# Altium project Sensor_Box_CAN_SENS.PrjPCB
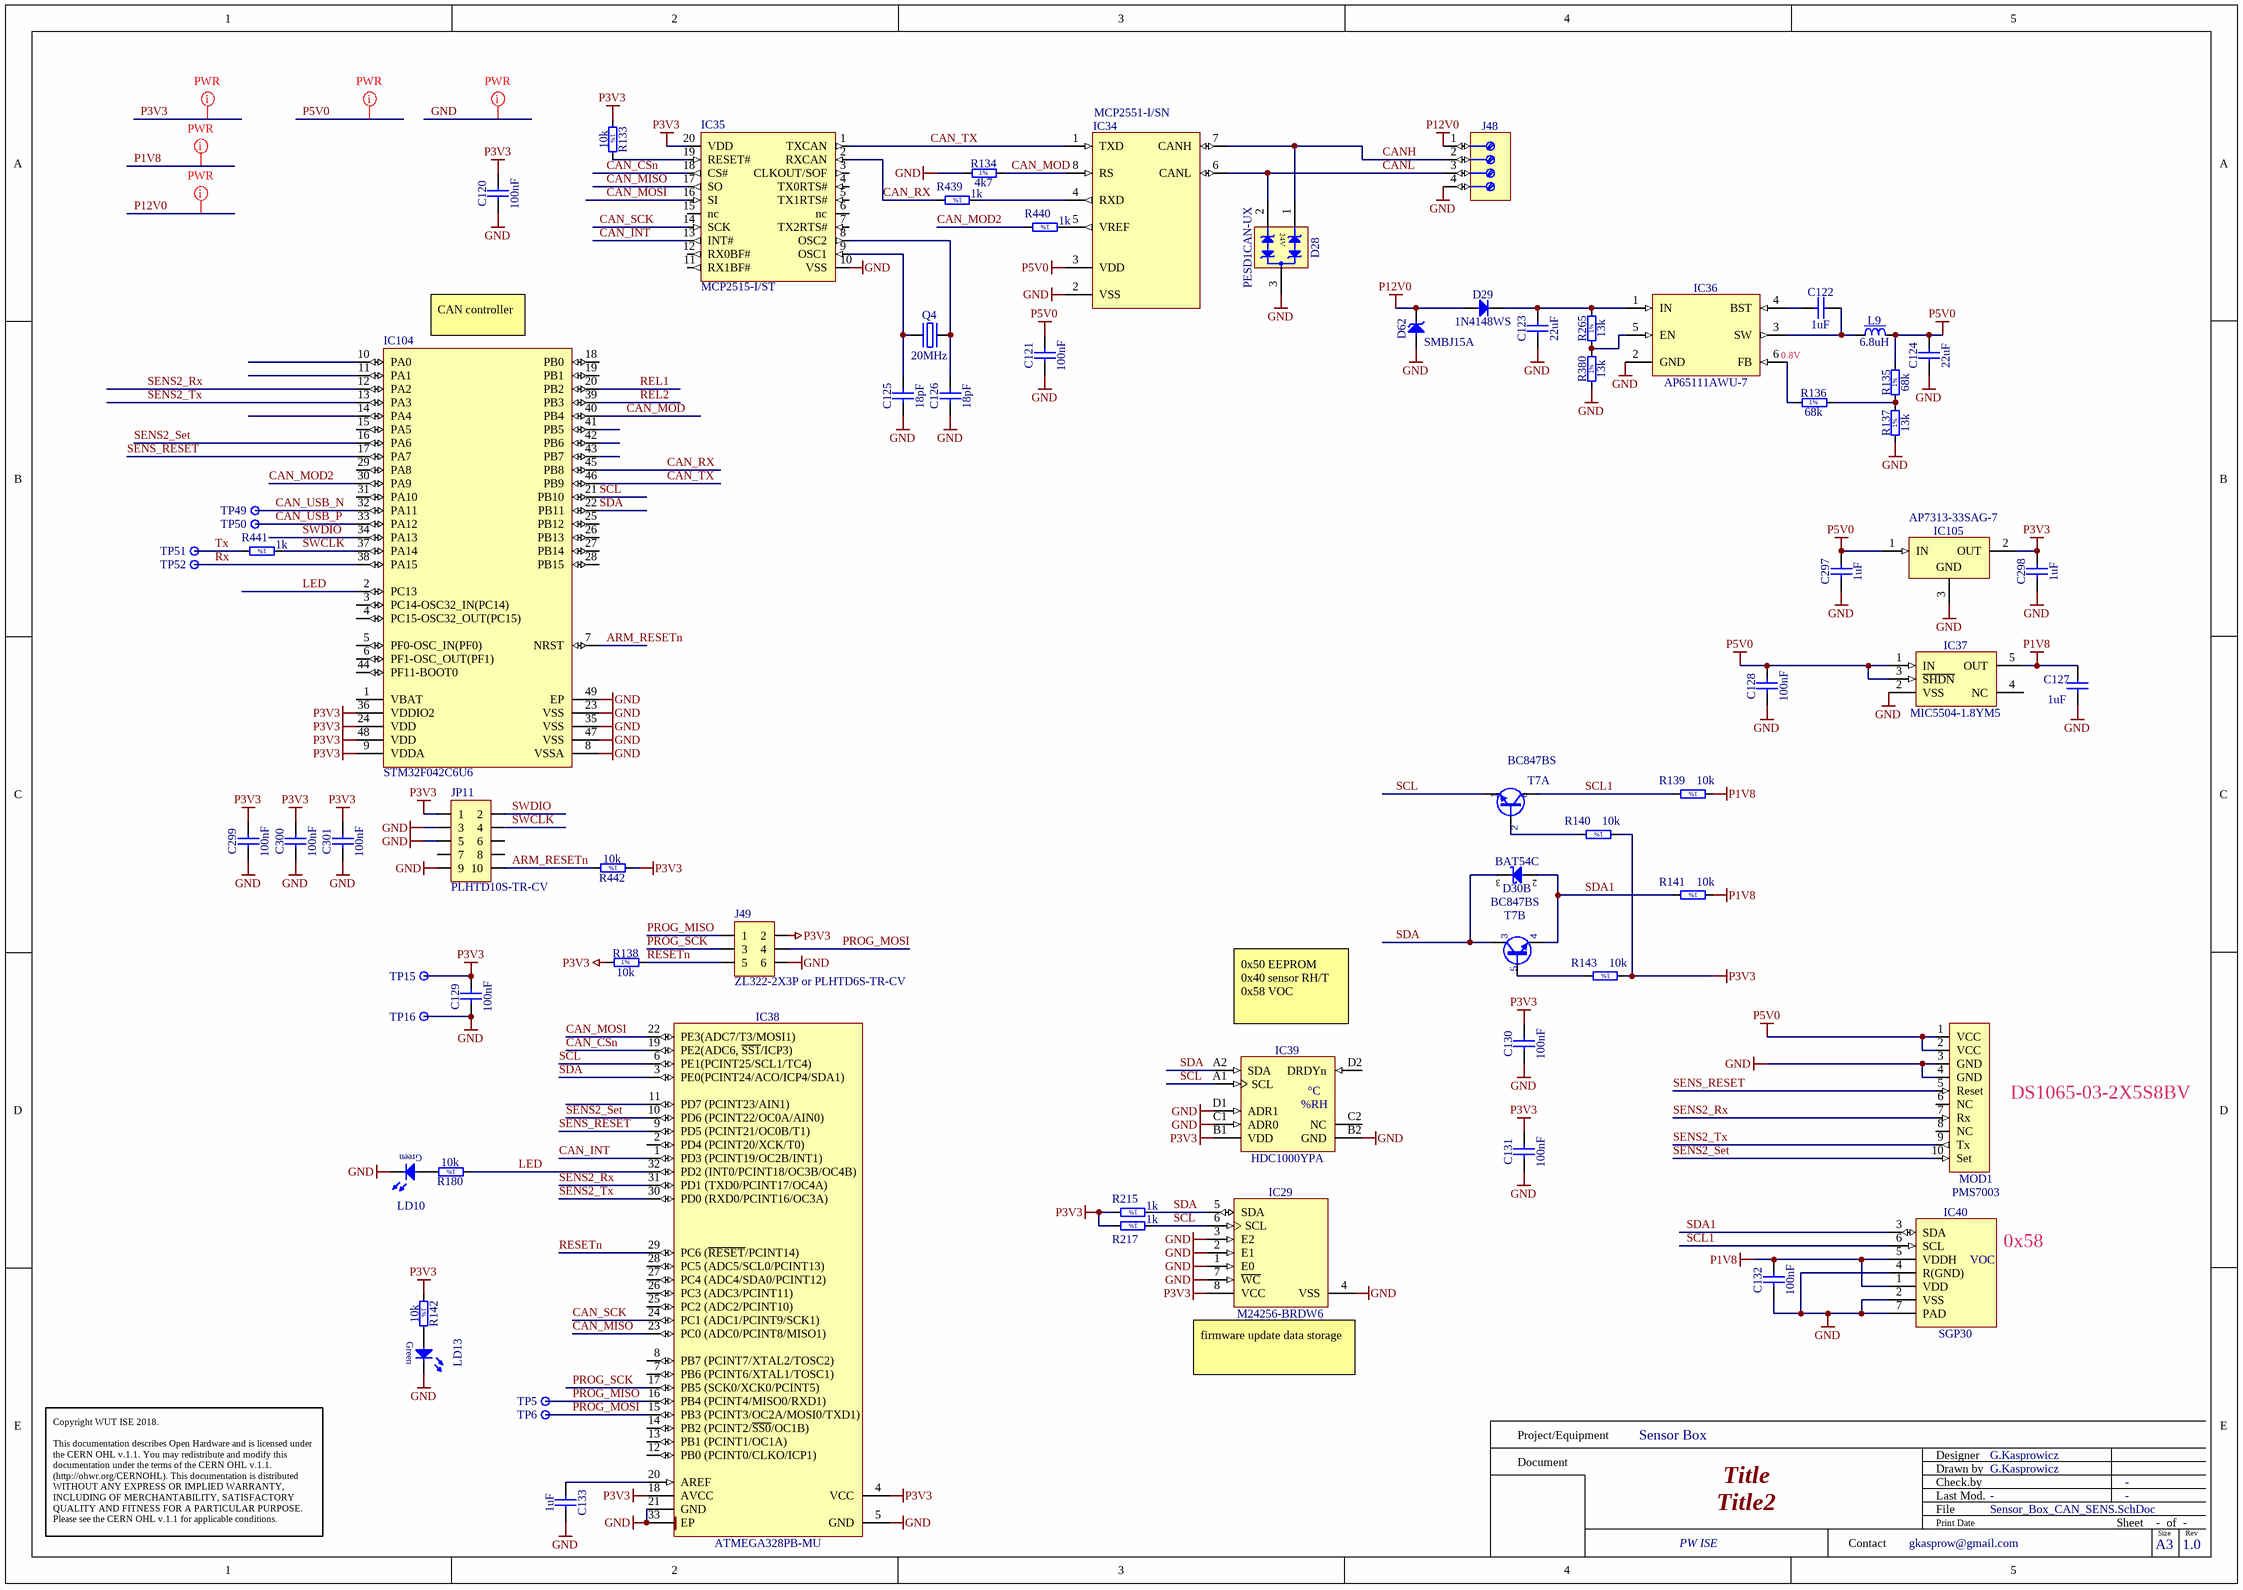
[diagram p0: Sensor_Box_CAN_SENS.SchDoc]
1 sheet, 70 parts. Net scope: global (net labels, ports and power ports of the same name join across sheets).
Board file: Sensor_Box_CAN_SENS.PCBDOC

## Sheet Sensor_Box_CAN_SENS.SchDoc: Title
size 420 x 297 mm; Author: G.Kasprowicz; CompanyName: WUT ISE; DrawnBy: G.Kasprowicz; Organization: WUT ISE; Address1: PW ISE; Address2: Nowowiejska 15/19 00-665 Warsaw; Address3: gkasprow@gmail.com; Revision: 1.0; SheetNumber: -; SheetTotal: -; ModifiedBy: -; CheckedDate: -; Title2: Title2; DivGrp: WUT ISE; Designer: G.Kasprowicz; ModifiedDate: -; ProjectName: Sensor Box

### Parts
C120  100nF  [CAPC1005X55N]
C121  100nF  [CAPC1005X55N]
C122  1uF  [CAPC1005X55N]
C123  22uF  [CAPC1709X100N]
C124  22uF  [CAPC1709X100N]
C125  18pF  [CAPC1005X55N]
C126  18pF  [CAPC1005X55N]
C127  1uF  [CAPC1608X87N]
C128  100nF  [CAPC1005X55N]
C129  100nF  [CAPC1005X55N]
C130  100nF  [CAPC1005X55N]
C131  100nF  [CAPC1005X55N]
C132  100nF  [CAPC1005X55N]
C133  1uF  [CAPC1005X55N]
C297  1uF  [CAPC1005X55N]
C298  1uF  [CAPC1005X55N]
C299  100nF  [CAPC1005X55N]
C300  100nF  [CAPC1005X55N]
C301  100nF  [CAPC1005X55N]
D28  PESD1CAN-UX  [SOT95P237X112-3N]
D29  1N4148WS  [SODFL2512X100N]
D30  BAT54C  [SOT95P240X130-3N]  (part B of 2)
D62  SMBJ15A  [DIOM5336X265N]
IC29  M24256-BRDW6  [SOP65P640X120-8N]
IC34  MCP2551-I/SN  [SOIC127P600X175-8N]
IC35  MCP2515-I/ST  [SOP65P640X110-20N]
IC36  AP65111AWU-7  [SOT95P280X100-6N]
IC37  MIC5504-1.8YM5  [SOT95P270X145-5N]
IC38  ATMEGA328PB-MU  [QFN50P500X500X100-33N-S325]
IC39  HDC1000YPA  [BGA8C100X50P2X4_159X204X68]
IC40  SGP30  [SON80P250X90_HS-7N]
IC104  STM32F042C6U6  [STM-UFQFPN48_L]
IC105  AP7313-33SAG-7  [SOT95P240X130-3N]
J48  (no value)  [PHOENIX_1725672]
J49  ZL322-2X3P or PLHTD6S-TR-CV  [ZL322-2X3P]
JP11  PLHTD10S-TR-CV  [PLHTD10S-TR-CV]
L9  6.8uH  [IND_WALSIN_WLPN3030]
LD10  Green  [LED_KINGBRIGHT_KPTR3216]  (value not drawn)
LD13  Green  [LED_KINGBRIGHT_KPTR3216]  (value not drawn)
MOD1  PMS7003  [PLANTOWER_PMS7003]
Q4  20MHz  [XTAL1160X490X430]
R133  10k  [RESC1005X40N]
R134  4k7  [RESC1005X40N]
R135  68k  [RESC1005X40N]
R136  68k  [RESC1005X40N]
R137  13k  [RESC1005X40N]
R138  10k  [RESC1005X40N]
R139  10k  [RESC1005X40N]
R140  10k  [RESC1005X40N]
R141  10k  [RESC1005X40N]
R142  10k  [RESC1005X40N]
R143  10k  [RESC1005X40N]
R180  10k  [RESC1005X40N]
R215  1k  [RESC1005X40N]
R217  1k  [RESC1005X40N]
R265  13k  [RESC1005X40N]
R380  13k  [RESC1005X40N]
R439  1k  [RESC1005X40N]
R440  1k  [RESC1005X40N]
R441  1k  [RESC1005X40N]
R442  10k  [RESC1005X40N]
T7  BC847BS  [SOT65P210X110-6N]  (parts A,B of 2)
TP5  Test Point  [TPS127]  (value not drawn)
TP6  Test Point  [TPS127]  (value not drawn)
TP15  Test Point  [TPS127]  (value not drawn)
TP16  Test Point  [TPS127]  (value not drawn)
TP49  Test Point  [TPS127]  (value not drawn)
TP50  Test Point  [TPS127]  (value not drawn)
TP51  Test Point  [TPS127]  (value not drawn)
TP52  Test Point  [TPS127]  (value not drawn)

### Nets
GND: C120.1 C121.1 C123.1 C124.1 C125.1 C126.1 C127.2 C128.1 C129.1 C130.1 C131.1 C132.1 C133.2 C297.1 C298.1 C299.1 C300.1 C301.1 D28.3(GND) D62.2(A) IC29.1(E0) IC29.2(E1) IC29.3(E2) IC29.4(VSS) IC29.7(~{WC}) IC34.2(VSS) IC35.10(VSS) IC36.2(GND) IC37.2(VSS) IC38.5(GND) IC38.21(GND) IC38.33(EP) IC39.B2(GND) IC39.C1(ADR0) IC39.D1(ADR1) IC40.2(VSS) IC40.4(R(GND)) IC40.7(PAD) IC104.8(VSSA) IC104.23(VSS) IC104.35(VSS) IC104.47(VSS) IC104.49(EP) IC105.3(GND) J48.4 J49.6 JP11.3 JP11.5 JP11.9 LD10.1(C) LD13.1(C) MOD1.3(GND) MOD1.4(GND) R134.1 R137.1 R380.1 TP16.1
P1V8: C127.1 C132.2 IC37.5(OUT) IC40.1(VDD) IC40.5(VDDH) R139.1 R141.1
P3V3: C120.2 C129.2 C130.2 C131.2 C298.2 C299.2 C300.2 C301.2 IC29.8(VCC) IC35.20(VDD) IC38.4(VCC) IC38.18(AVCC) IC39.B1(VDD) IC104.9(VDDA) IC104.24(VDD) IC104.36(VDDIO2) IC104.48(VDD) IC105.2(OUT) J49.2 JP11.1 R133.1 R138.1 R140.1 R142.1 R143.1 R215.2 R217.2 R442.1 TP15.1
P5V0: C121.2 C124.2 C128.2 C297.2 IC34.3(VDD) IC37.1(IN) IC37.3(~{SHDN}) IC105.1(IN) L9.2 MOD1.1(VCC) MOD1.2(VCC) R135.2
P12V0: D29.2(A) D62.1(C) J48.1
ARM_RESETn: IC104.7(NRST) JP11.10 R442.2
CAN_CSn: IC35.18(CS#) IC38.19(PE2(ADC6,_~{SS1}/ICP3))
CAN_INT: IC35.13(INT#) IC38.1(PD3_(PCINT19/OC2B/INT1))
CAN_MISO: IC35.17(SO) IC38.23(PC0_(ADC0/PCINT8/MISO1))
CAN_MOD: IC34.8(RS) IC104.40(PB4) R134.2
CAN_MOD2: IC104.30(PA9) R440.2
CAN_MOSI: IC35.16(SI) IC38.22(PE3(ADC7/T3/MOSI1))
CAN_RX: IC35.2(RXCAN) IC104.45(PB8) R439.2
CAN_SCK: IC35.14(SCK) IC38.24(PC1_(ADC1/PCINT9/SCK1))
CAN_TX: IC34.1(TXD) IC35.1(TXCAN) IC104.46(PB9)
CAN_USB_N: IC104.32(PA11) TP49.1
CAN_USB_P: IC104.33(PA12) TP50.1
CANH: D28.1(I/O1) IC34.7(CANH) J48.2
CANL: D28.2(I/O2) IC34.6(CANL) J48.3
LED: IC38.32(PD2_(INT0/PCINT18/OC3B/OC4B)) IC104.2(PC13) R180.1
PROG_MISO: IC38.16(PB4_(PCINT4/MISO0/RXD1)) J49.1 TP5.1
PROG_MOSI: IC38.15(PB3_(PCINT3/OC2A/MOSI0/TXD1)) J49.4 TP6.1
PROG_SCK: IC38.17(PB5_(SCK0/XCK0/PCINT5)) J49.3
REL1: IC104.20(PB2)
REL2: IC104.39(PB3)
RESETn: IC38.29(PC6_(~{RESET}/PCINT14)) J49.5 R138.2
Rx: IC104.38(PA15) TP52.1
SCL: IC29.6(SCL) IC38.6(PE1(PCINT25/SCL1/TC4)) IC39.A1(SCL) IC104.21(PB10) R217.1 T7.1(E)
SCL1: IC40.6(SCL) R139.2 T7.6(C)
SDA: D30.3(COMC) IC29.5(SDA) IC38.3(PE0(PCINT24/ACO/ICP4/SDA1)) IC39.A2(SDA) IC104.22(PB11) R215.1 T7.3(C)
SDA1: D30.2(A) IC40.3(SDA) R141.2 T7.4(E)
SENS2_Rx: IC38.31(PD1_(TXD0/PCINT17/OC4A)) IC104.12(PA2) MOD1.7(Rx)
SENS2_Set: IC38.10(PD6_(PCINT22/OC0A/AIN0)) IC104.16(PA6) MOD1.10(Set)
SENS2_Tx: IC38.30(PD0_(RXD0/PCINT16/OC3A)) IC104.13(PA3) MOD1.9(Tx)
SENS_RESET: IC38.9(PD5_(PCINT21/OC0B/T1)) IC104.17(PA7) MOD1.5(Reset)
SWCLK: IC104.37(PA14) JP11.4 R441.1
SWDIO: IC104.34(PA13) JP11.2
Tx: R441.2 TP51.1
NetC122_1: C122.1 IC36.4(BST)
NetC122_2: C122.2 IC36.3(SW) L9.1
NetC123_2: C123.2 D29.1(C) IC36.1(IN) R265.2
NetC125_2: C125.2 IC35.9(OSC1) Q4.1(OSC1)
NetC126_2: C126.2 IC35.8(OSC2) Q4.2(OSC2)
NetC133_1: C133.1 IC38.20(AREF)
NetIC34_4: IC34.4(RXD) R439.1
NetIC34_5: IC34.5(VREF) R440.1
NetIC35_19: IC35.19(RESET#) R133.2
NetIC36_5: IC36.5(EN) R265.1 R380.2
NetIC36_6: IC36.6(FB) R136.1
NetLD10_2: LD10.2(A) R180.2
NetLD13_2: LD13.2(A) R142.2
NetR135_1: R135.1 R136.2 R137.2
NetR140_2: R140.2 T7.2(B)
NetR143_2: R143.2 T7.5(B)

Not connected (* = marked no-connect by the designer): IC35 3(CLKOUT/SOF) 4(TX0RTS#) 5(TX1RTS#) 6(nc) 7(TX2RTS#) 11(RX1BF#) 12(RX0BF#) 15(nc); IC37 4(NC); IC38 2(PD4_(PCINT20/XCK/T0)) 7(PB6_(PCINT6/XTAL1/TOSC1)) 8(PB7_(PCINT7/XTAL2/TOSC2)) 11(PD7_(PCINT23/AIN1)) 12(PB0_(PCINT0/CLKO/ICP1)) 13(PB1_(PCINT1/OC1A)) 14(PB2_(PCINT2/~{SS0}/OC1B)) 25(PC2_(ADC2/PCINT10)) 26(PC3_(ADC3/PCINT11)) 27(PC4_(ADC4/SDA0/PCINT12)) 28(PC5_(ADC5/SCL0/PCINT13)); IC39 C2(NC) D2(DRDYn); IC104 1(VBAT) 3(PC14-OSC32_IN(PC14)) 4(PC15-OSC32_OUT(PC15)) 5(PF0-OSC_IN(PF0)) 6(PF1-OSC_OUT(PF1)) 10(PA0) 11(PA1) 14(PA4) 15(PA5) 18(PB0) 19(PB1) 25(PB12) 26(PB13) 27(PB14) 28(PB15) 29(PA8) 31(PA10) 41(PB5) 42(PB6) 43(PB7) 44(PF11-BOOT0); JP11 6 7 8; MOD1 6(NC) 8(NC)

### Layout directives
net class PWR: GND, P1V8, P3V3, P5V0, P12V0

### Notes on the sheet
- (near IC104) CAN controller
- (near IC36) 0.8V
- (near IC39) 0x50 EEPROM
  0x40 sensor RH/T
  0x58 VOC
- DS1065-03-2X5S8BV
- 0x58
- (near IC29) firmware update data storage
- Project/Equipment
- Document
- Designer
- Drawn by
- Check.by
- Copyright WUT ISE 2018.
  This documentation describes Open Hardware and is licensed under the CERN OHL v.1.1. You may redistribute and modify this documentation under the terms of the CERN OHL v.1.1. (http://ohwr.org/CERNOHL). This documentation is distributed WITHOUT ANY EXPRESS OR IMPLIED WARRANTY, INCLUDING OF MERCHANTABILITY, SATISFACTORY QUALITY AND FITNESS FOR A PARTICULAR PURPOSE. Please see the CERN OHL v.1.1 for applicable conditions.
- Contact
- File
- Last Mod.
- Print Date
- Sheet
- Size
- A3
- of
- Rev
- (in symbol HDC1000YPA) °C; %RH
- (in symbol R0402_1K_1%_0.0625W_100PPM) 1%
- (in symbol R0402_4K7_1%_0.0625W_100PPM) 1%
- (in symbol R0402_10K_1%_0.0625W_100PPM) 1%
- (in symbol R0402_13K_1%_0.0625W_100PPM) 1%
- (in symbol R0402_68K_1%_0.0625W_100PPM) 1%
- (in symbol SENS_SGP30) VOC

### Library data of the parts
C120 C121 C128-C132 C299-C301 = CC0402_100NF_16V_10%_X5R: Non-polarised capacitor; Part Description: SMD Multilayer Chip Ceramic Capacitor; Manufacturer: GENERIC; Manufacturer1 Part Number: GRM155R61C104KA88D; Voltage: 16V; TC: X5R; Tolerance: ±10%; Part Number: CC0402_100NF_16V_10%_X5R; Component Kind: Standard; Component Type: Standard; Pin Count: 2; Value: 100nF; Status: None; Manufacturer Part Number: CC0402_100NF_16V_10%_X5R; Case: 0402; Mounted: Yes; Socket: No; SMD: Yes; Sense: No; Manufacturer1 Example: MURATA; Manufacturer1 ComponentHeight: 0.55mm; HelpURL: \\cern.ch\dfs\Applications\Altium\Datasheets\CC0402_X5R_MURATA_GRM.pdf; Author: CERN DEM JLC; CreateDate: 10.12.2013; LatestRevisionDate: 10.12.2013
C122 C133 C297 C298 = CC0402_1UF_16V_10%_X5R: Non-polarised capacitor; Part Description: SMD Multilayer Chip Ceramic Capacitor; Manufacturer: GENERIC; Manufacturer1 Part Number: C1005X5R1C105KT; Voltage: 16V; TC: X5R; Tolerance: ±10%; Part Number: CC0402_1UF_16V_10%_X5R; Component Kind: Standard; Component Type: Standard; Pin Count: 2; Value: 1uF; Status: Preferred; Manufacturer Part Number: CC0402_1UF_16V_10%_X5R; Case: 0402; Mounted: Yes; Socket: No; SMD: Yes; Sense: No; Manufacturer1 Example: TDK; Manufacturer1 ComponentHeight: 0.55mm; HelpURL: \\cern.ch\dfs\Applications\Altium\Datasheets\CC0402_X5R_TDK_C.pdf; Author: CERN DEM JLC; CreateDate: 25.10.2012; LatestRevisionDate: 25.10.2012
C123 C124 = CC0603_22UF_6.3V_20%_X5R: Non-polarised capacitor; Part Description: SMD Multilayer Chip Ceramic Capacitor; Manufacturer: GENERIC; Manufacturer1 Part Number: C1608X5R0J226M080AC; Voltage: 6.3V; TC: X5R; Tolerance: ±20%; Part Number: CC0603_22UF_6.3V_20%_X5R; Component Kind: Standard; Component Type: Standard; Pin Count: 2; Value: 22uF; Status: None; Manufacturer Part Number: CC0603_22UF_6.3V_20%_X5R; Case: 0603; Mounted: Yes; Socket: No; SMD: Yes; Sense: No; Manufacturer1 Example: TDK; Manufacturer1 ComponentHeight: 1mm; HelpURL: \\cern.ch\dfs\Applications\Altium\Datasheets\CC0603_X5R_TDK_C.pdf; Author: CERN DEM JLC; CreateDate: 16.12.2013; LatestRevisionDate: 13.09.2016
C125 C126 = CC0402_18PF_50V_5%_C0G: Non-polarised capacitor; Part Description: SMD Multilayer Chip Ceramic Capacitor; Manufacturer: GENERIC; Manufacturer1 Part Number: C0402C180J5GACTU; Voltage: 50V; TC: C0G/NP0; Tolerance: ±5%; Part Number: CC0402_18PF_50V_5%_C0G; Component Kind: Standard; Component Type: Standard; Pin Count: 2; Value: 18pF; Status: Preferred; Manufacturer Part Number: CC0402_18PF_50V_5%_C0G; Case: 0402; Mounted: Yes; Socket: No; SMD: Yes; Sense: No; Manufacturer1 Example: KEMET; Manufacturer1 ComponentHeight: 0.55mm; HelpURL: \\cern.ch\dfs\Applications\Altium\Datasheets\CC0805_C0G_KEMET_(Commercial Grade).pdf; Author: CERN DEM JLC; CreateDate: 04.10.2016; LatestRevisionDate: 04.10.2016
C127 = CC0603_1UF_25V_10%_X7R: Non-polarised capacitor; Part Description: SMD Multilayer Chip Ceramic Capacitor; Manufacturer: GENERIC; Manufacturer1 Part Number: GRM188R71E105KA12D; Voltage: 25V; TC: X7R; Tolerance: ±10%; Table: Capacitors SMD; Part Number: CC0603_1UF_25V_10%_X7R; Component Kind: Standard; Component Type: Standard; Pin Count: 2; Value: 1uF; Status: None; Manufacturer Part Number: CC0603_1UF_25V_10%_X7R; Case: 0603; Mounted: Yes; Socket: No; SMD: Yes; Manufacturer1 Example: MURATA; Manufacturer1 ComponentHeight: 0.9mm; HelpURL: \\cern.ch\dfs\Applications\Altium\Datasheets\CC0603_X7R_MURATA.pdf; Author: CERN DEM JLC; CreateDate: 2011-01-18; LatestRevisionDate: 2011-01-18
D28 = D_TVS_PESD1CAN: TVS Diode for CAN; Manufacturer: Nexperia; Voltage: 24V; Power: 400W; PressFit: No; Bonding: No; Part Number: PESD1CAN-UX; Component Kind: Standard; Component Type: Standard; Device: PESD1CAN-UX; PackageDescription: SOT, 0.95mm, pitch; 3 pin,1.30mm W X 2.92mm L X 1.12mm H body, IPC Medium Density; Part Description: TVS Diode for CAN; Manufacturer Part Number: PESD1CAN-UX; Pin Count: 3; Case: SOT-23; Mounted: Yes; Socket: No; SMD: Yes; Sense: No; ComponentHeight: 1.12mm; HelpURL: \\cern.ch\dfs\Applications\Altium\Datasheets\SM712.TCT.pdf; Author: CERN DEM JLC; CreateDate: 03.09.2014; LatestRevisionDate: 13.01.2015
D29 = 1N4148WS: Diode; Part Description: Small Signal Diodes; Manufacturer: FAIRCHILD SEMICONDUCTOR; Voltage: 75V; Power: 150mA; PressFit: No; Bonding: No; Part Number: 1N4148WS; Component Kind: Standard; Component Type: Standard; Device: 1N4148WS; PackageDescription: SODFL Diode; 1.70mm W X 1.25mm L X 1.00mm H body, IPC Medium Density; Manufacturer Part Number: 1N4148WS; Pin Count: 2; Case: SOD-323F; Mounted: Yes; Socket: No; SMD: Yes; Sense: No; ComponentHeight: 1mm; HelpURL: \\cern.ch\dfs\Applications\Altium\Datasheets\1N4148WS.pdf; Author: CERN DEM JLC; CreateDate: 12.05.2011; LatestRevisionDate: 12.05.2011
D30 = BAT54C: Dual Common Cathode Schottky Diodes; Part Description: Dual Common Cathode Small Signal Schottky Diode; Manufacturer: FAIRCHILD SEMICONDUCTOR; Voltage: 30V; Power: 200mA; PressFit: No; Bonding: No; Part Number: BAT54C; Component Kind: Standard; Component Type: Standard; Device: BAT54C; PackageDescription: SOT23 3-Leads, Pitch 0.95mm - Body 1.3x2.9mm, IPC Medium Density; Manufacturer Part Number: BAT54C; Pin Count: 3; Case: SOT23-3; Mounted: Yes; Socket: No; SMD: Yes; Sense: No; ComponentHeight: 1.30mm; HelpURL: \\cern.ch\dfs\Applications\Altium\Datasheets\BAT54C.pdf; Author: CERN DEM JLC; CreateDate: 17.09.2009; LatestRevisionDate: 27.05.2010
D62 = SMBJ15A: Zener Diode; Part Description: Uni-Directional Transient Voltage Suppressor Diode; Manufacturer: FAIRCHILD SEMICONDUCTOR; Voltage: 15V; Power: 600W; PressFit: No; Bonding: No; Part Number: SMBJ15A; Component Kind: Standard; Component Type: Standard; Device: SMBJ15A; PackageDescription: DO-214-AA/SMB Diode, Molded Body; 5.34mm L X 3.625mm W X 2.65mm H, IPC Medium Density; Manufacturer Part Number: SMBJ15A; Pin Count: 2; Case: DO-214AA; Mounted: Yes; Socket: No; SMD: Yes; Sense: No; ComponentHeight: 2.65mm; HelpURL: \\cern.ch\dfs\Applications\Altium\Datasheets\SMBJ.pdf; Author: CERN DEM JLC; CreateDate: 08.12.2008; LatestRevisionDate: 19.12.2011
IC29 = MEM_M24256-BRDW6P: 256-Kbit Serial I²C Bus EEPROM; Manufacturer: ST MICROELECTRONICS; PressFit: No; Bonding: No; Part Number: M24256-BRDW6P; Component Kind: Standard; Component Type: Standard; Device: M24256-BRDW6; PackageDescription: SOP, 0.65mm pitch; 8 pin, 4.40mm W X 3.00mm L X 1.20mm H body, IPC Medium Density; Part Description: 256-Kbit Serial I²C Bus EEPROM; Manufacturer Part Number: M24256-BRDW6; Pin Count: 8; Case: TSSOP8; Mounted: Yes; Socket: No; SMD: Yes; Sense: No; ComponentHeight: 1.2mm; HelpURL: \\cern.ch\dfs\Applications\Altium\Datasheets\M24256-BRDW6P.pdf; Author: CERN DEM MR; CreateDate: 17.03.2016; LatestRevisionDate: 17.03.2016
IC34 = IFC_MCP2551: High-Speed CAN Transceiver, 8-Pin SOIC, Industrial Temperature; Manufacturer: MICROCHIP TECHNOLOGY; PressFit: No; Bonding: No; Part Number: MCP2551-I/SN; Component Kind: Standard; Component Type: Standard; Device: MCP2551-I/SN; PackageDescription: SOIC 8, Pitch 1.27mm - Body 4x5mm, IPC Medium Density; Part Description: High-Speed CAN Transceiver; Manufacturer Part Number: MCP2551-I/SN; Pin Count: 8; Case: SOIC8; Mounted: Yes; Socket: No; SMD: Yes; Sense: No; ComponentHeight: 1.75mm; Author: GK; CreateDate: 07.09.2016; LatestRevisionDate: 07.09.2016
IC35 = IFC_MCP2515_TSSOP: CAN Controller With SPI nterface; Manufacturer: Microchip; Manufacturer Part Number: MCP2515T-I/ST; Part Description: Stand-Alone CAN Controller with SPI Interface; Case: TSSOP20; Component Type: Standard; Device: MCP2515; Mounted: Yes; PackageDescription: TSSOP 20, Pitch 0.65mm - Body 4.5x6.5mm, IPC Medium Density; Part Number: MCP2515T-I/ST; Pin Count: 20; SMD: Yes
IC36 = AP65111AWU-7: Light Load Improved 1.5A Synch DC/DC Buck Converter; Manufacturer: DIODES INCORPORATED; PressFit: No; Bonding: No; Part Number: AP65111AWU-7; Component Kind: Standard; Component Type: Standard; Device: AP65111AWU-7; PackageDescription: SOT23, 0.95mm pitch; 6 pin, 1.625mm W X 2.90mm L X 1.00mm H body, IPC Medium Density; Part Description: Light Load Improved 1.5A Synch DC/DC Buck Converter; Manufacturer Part Number: AP65111AWU-7; Pin Count: 6; Case: SOT23-6; Mounted: Yes; Socket: No; SMD: Yes; Sense: No; ComponentHeight: 1.1mm; HelpURL: \\cern.ch\dfs\Applications\Altium\Datasheets\AP65111AWU-7.pdf; Author: CERN DEM JLC; CreateDate: 20.03.2018; LatestRevisionDate: 20.03.2018
IC37 = REG_MIC5504-1.8: 300mA, High PSRR, Low Quiescent Current LDO; Part Description: 1.8V, 300mA, High PSRR, Low Quiescent Current LDO; Manufacturer: MICROCHIP TECHNOLOGY; PressFit: No; Bonding: No; Part Number: MIC5504-1.8YM5; Component Kind: Standard; Component Type: Standard; Device: MIC5504-1.8YM5; PackageDescription: SOT, 0.95mm Pitch; 5 Pin,1.55mm W X 2.90mm L X 1.45mm H body, IPC Medium Density; Manufacturer Part Number: MIC5504-1.8YM5; Pin Count: 3; Case: SOT23-5; Mounted: Yes; Socket: No; SMD: Yes; Sense: No; ComponentHeight: 1.45mm; HelpURL: \\cern.ch\dfs\Applications\Altium\Datasheets\MCP1802T-3002I-OT.pdf; Author: GK; CreateDate: 03.05.2012; LatestRevisionDate: 17.09.2014
IC38 = UPC_ATMEGA328PB-MU: 8-bit AVR 20MHz Microcontroller With 32K Bytes In-System  Programmable  Flash; Part Description: 8-bit AVR Microcontroller, 32KB Flash, 1KB EEPROM, 2KB SRAM, 32-pin MLF, Industrial Grade (-40°C to 85°C); Manufacturer: ATMEL; PressFit: No; Bonding: No; Part Number: ATMEGA328PB-MU; Component Kind: Standard; Component Type: Standard; Device: ATMEGA328PB-MU; PackageDescription: QFN, (MO-220-VHHD-2) 0.50mm pitch,square; 8 pin X 8 pin, 5mm X 5mm X 1.00mm H body (w/thermal tab 3.25 X 3.25mm),  IPC Medium Density; Manufacturer Part Number: ATMEGA328PB-MU; Pin Count: 33; Case: QFN32; Mounted: Yes; Socket: No; SMD: Yes; Sense: No; ComponentHeight: 1mm; HelpURL: \\cern.ch\dfs\Applications\Altium\Datasheets\ATMEGA328P-MU.pdf; Author: GK; CreateDate: 2011-02-08; LatestRevisionDate: 2014-07-02
IC39 = HDC1000YPA: Low Power, High Accuracy Digital Humidity Sensor With Temperature Sensor; Manufacturer: TEXAS INSTRUMENTS; PressFit: No; Bonding: No; Part Number: HDC1000YPA; Component Kind: Standard; Component Type: Standard; Device: HDC1000YPA; PackageDescription: BGA, 1.00mm pitch, Body 1.59x2.04x0.68mm; 8 pin, 2 columns X 4 rows; Part Description: Low Power, High Accuracy Digital Humidity Sensor With Temperature Sensor; Manufacturer Part Number: HDC1000YPA; Pin Count: 8; Case: DSBGA8; Mounted: Yes; Socket: No; SMD: Yes; Sense: No; ComponentHeight: 0.68mm; HelpURL: \\cern.ch\dfs\Applications\Altium\Datasheets\HDC1000YPA.pdf; Author: CERN DEM MR; CreateDate: 08.02.2016; LatestRevisionDate: 08.02.2016
IC40 = SENS_SGP30: MEMS metal  -  oxide gas sensor for measuring  volatile organic compounds (VOCs); Manufacturer: SENSIRION; PressFit: No; Sense Comment: Non-washable; Bonding: No; Part Number: SGP30; Component Kind: Standard; Component Type: Standard; Device: SGP30; Footprint: SENSIRION_SGP30; PackageDescription: DFN 2.45 x 2.45 x 0.9 mm; Part Description: MEMS metal - oxide gas sensor for measuring  volatile organic compounds (VOCs); Manufacturer Part Number: SGP30; Pin Count: 6; Case: DFN6; Mounted: Yes; Socket: No; SMD: Yes; Sense: Yes; ComponentHeight: 0.9; HelpURL: \\cern.ch\dfs\Applications\Altium\Datasheets\SHT21S.pdf; Author: CERN DEM JLC; CreateDate: 27.02.2013; LatestRevisionDate: 09.11.2017
IC104 = CMP-0304-00104-1: ARM Cortex-M0 32-bit MCU, 32 KB Flash, 6 KB Internal RAM, 38 I/Os, 48-Pin UFQFPN, -40 to 85 degC, Tray; Internal RAM Size (kB): 6; Supply Voltage(Vcc) min (V): 2; I/Os (High Current): 38; FLASH Size (Prog) (kB): 32; Operating Frequency(F) (Processor speed) (MHz): 48; ComponentLink2Description: Datasheet; Mounting Technology: Surface Mount; ComponentLink1Description: Manufacturer URL; ComponentLink1URL: http://www.st.com/; Core: ARM Cortex-M0; Package Reference: UFQFPN48; Packing: Tray; ComponentLink2URL: http://www.st.com/st-web-ui/static/active/en/resource/technical/document/datasheet/DM00105814.pdf; DatasheetVersion: Rev. 5; Package Description: 48-Pin Ultra Thin Fine Pitch Quad Flat No-Lead, 7 x 7 x 0.6 mm Body, 0.5 mm Pitch, Exposed Pad
IC105 = AP7313-33SAG-7: 3-Terminal Regulator 1=IN 2=OUT 3=GND; Part Description: 3.3V, 150mA Low Quiescent Current, Fast Transient Low Dropout Linear Regulator; Manufacturer: DIODES INCORPORATED; PressFit: No; Bonding: No; Part Number: AP7313-33SAG-7; Component Kind: Standard; Component Type: Standard; Device: AP7313-33SAG-7; PackageDescription: SOT23 3-Leads, Pitch 0.95mm - Body 1.3x2.9mm, IPC Medium Density; Manufacturer Part Number: AP7313-33SAG-7; Pin Count: 3; Case: SOT23; Mounted: Yes; Socket: No; SMD: Yes; Sense: No; ComponentHeight: 1.35mm; HelpURL: \\cern.ch\dfs\Applications\Altium\Datasheets\AP7313-33SAG-7.pdf; Author: CERN DEM JLC; CreateDate: 20.03.2018; LatestRevisionDate: 20.03.2018
J48 = PHOENIX_1725672: Terminal Block, 4 Positions, Screw Connection; Part Description: 6A, 63V, Terminal Block, Pitch 2.54mm, 4 Positions, Screw Connection; Manufacturer: PHOENIX CONTACT; Manufacturer Part Number: 1725672 (MPT 0,5/4-2,54); PressFit: No; Part Number: PHOENIX_1725672; Component Kind: Standard; Component Type: Standard; Pin Count: 4; Mounted: Yes; Socket: No; SMD: No; Sense: No; Status: None; ComponentHeight: 8.5mm; HelpURL: \\cern.ch\dfs\Applications\Altium\Datasheets\PHOENIX_1725672.pdf; Author: CERN DEM JMW; CreateDate: 07.11.2008; LatestRevisionDate: 26.04.2010
J49 = CON_2x3 1.27 SMT Male: 1.27 mm dual row goldpin (Maritex)
JP11 = CON_2x5 1.27 SMT Male: 1.27 mm dual row goldpin (Maritex)
L9 = IND_WLPN3030: 6,8uH; 900mA; 0,211Ω; 3x3x1,5mm; Part Number: IND_6.8UH_20%_WALSIN_WLPN303015M6R8PB; Part Description: Miniature Surface Mount Power Inductor (8200 Series); Manufacturer: WALSIN; Manufacturer Part Number: WLPN303015M6R8PB; Resistance: 0.21R; Tolerance: ±20%; Component Kind: Standard; Component Type: Standard; Pin Count: 2; Value: 6.8uH; Status: None; Power: 900mA; Mounted: Yes; Socket: No; SMD: Yes; Sense: No; ComponentHeight: 1.5; HelpURL: \\cern.ch\dfs\Applications\Altium\Datasheets\IND_MURATA-PS_8200.pdf; Author: GK; CreateDate: 11.07.2016; LatestRevisionDate: 11.07.2016
LD10 LD13 = LED_KINGBRIGHT_KPTR-3216CGCK: LED Green 1A 2C; Part Description: Reverse Mount LED 1.4x1.6mm Green; PressFit: No; Bonding: No; Part Number: LED_KINGBRIGHT_KPTR-3216CGCK; Component Kind: Standard; Component Type: Standard; Color: Green; PackageDescription: Reverse Mount LED 3216, Hole 2.1x2.3mm 0.35mm Height; Manufacturer: KINGBRIGHT; Manufacturer Part Number: KPTR-3216CGCK; Pin Count: 2; Mounted: Yes; Socket: No; SMD: Yes; Sense: No; ComponentHeight: 0.35mm; HelpURL: \\cern.ch\dfs\Applications\Altium\Datasheets\LED_KINGBRIGHT_KPTR-3216CGCK.pdf; Author: CERN DEM MR; CreateDate: 15.02.2016; LatestRevisionDate: 15.02.2016
MOD1 = SENS_PMS7003: Digital universal particle concentration sensor; Manufacturer: PLANTOWER; PressFit: No; Bonding: No; Part Number: PMS7003; Component Kind: Standard; Component Type: Standard; Device: PMS7003; PackageDescription: Module 48x37x12, 10 pin; Part Description: Digital universal particle concentration sensor; Manufacturer Part Number: PMS7003; Pin Count: 10; Mounted: Yes; Socket: No; SMD: Yes; Sense: No; ComponentHeight: 12; HelpURL: \\cern.ch\dfs\Applications\Altium\Datasheets\HGT-2101.pdf; Author: GK; CreateDate: 14.01.2018; LatestRevisionDate: 14.01.2018
Q4 = X_CRYSTAL_20M_HC49: Quartz Crystal 20MHz, 30ppm, 20pF; Part Number: SR PASSIVES 20M-49SMD-SR; Part Description: Tolerance:± 30ppm, Stability:± 50ppm, -10°C to +60°C, 20pF, Surface Mount Quartz Crystal, HC49/4HSMX Series; Manufacturer: SR PASSIVES; Manufacturer Part Number: 20M-49SMD-SR; PressFit: No; Bonding: No; Component Kind: Standard; Component Type: Standard; PackageDescription: HC49/4H SMX Case, SMD Cristal, Body 11.6x4.9mm; Value: 20MHz; Pin Count: 2; Mounted: Yes; Socket: No; SMD: Yes; Sense: No; ComponentHeight: 4.3mm; HelpURL: \\cern.ch\dfs\Applications\Altium\Datasheets\XTAL_IQD_LFXTAL003166.pdf; Author: GK; CreateDate: 19.04.2012; LatestRevisionDate: 07.11.2016
R133 R138 R142 R180 R442 = R0402_10K_1%_0.0625W_100PPM: Resistor - 1%; Part Description: General Purpose Thick Film Chip Resistor; Manufacturer: GENERIC; Manufacturer1 Part Number: 232270671003L; TC: ±100ppm/°C; PressFit: No; Part Number: R0402_10K_1%_0.0625W_100PPM; Component Kind: Standard; Component Type: Standard; Pin Count: 2; Value: 10k; Status: Not Recommended; Power: 0.0625W; Tolerance: ±1%; Manufacturer Part Number: R0402_10K_1%_0.0625W_100PPM; Case: 0402; Mounted: Yes; Sense: No; Socket: No; SMD: Yes; Manufacturer1 Example: YAGEO PHYCOMP; Manufacturer1 ComponentHeight: 0.4mm; HelpURL: \\cern.ch\dfs\Applications\Altium\Datasheets\R0402_Phycomp_RC0402.pdf; Author: CERN DEM JLC; CreateDate: 03.12.2007; LatestRevisionDate: 17.10.2012
R134 = R0402_4K7_1%_0.0625W_100PPM: Resistor - 1%; Part Description: General Purpose Thick Film Chip Resistor; Manufacturer: GENERIC; Manufacturer1 Part Number: 232270674702L; TC: ±100ppm/°C; PressFit: No; Part Number: R0402_4K7_1%_0.0625W_100PPM; Component Kind: Standard; Component Type: Standard; Pin Count: 2; Value: 4k7; Status: Not Recommended; Power: 0.0625W; Tolerance: ±1%; Manufacturer Part Number: R0402_4K7_1%_0.0625W_100PPM; Case: 0402; Mounted: Yes; Sense: No; Socket: No; SMD: Yes; Manufacturer1 Example: YAGEO PHYCOMP; Manufacturer1 ComponentHeight: 0.4mm; HelpURL: \\cern.ch\dfs\Applications\Altium\Datasheets\R0402_Phycomp_RC0402.pdf; Author: CERN DEM JLC; CreateDate: 03.12.2007; LatestRevisionDate: 17.10.2012
R135 R136 = R0402_68K_1%_0.0625W_100PPM: Resistor - 1%; Part Description: General Purpose Thick Film Chip Resistor; Manufacturer: GENERIC; Manufacturer1 Part Number: 232270676803L; TC: ±100ppm/°C; PressFit: No; Part Number: R0402_68K_1%_0.0625W_100PPM; Component Kind: Standard; Component Type: Standard; Pin Count: 2; Value: 68k; Status: Not Recommended; Power: 0.0625W; Tolerance: ±1%; Manufacturer Part Number: R0402_68K_1%_0.0625W_100PPM; Case: 0402; Mounted: Yes; Sense: No; Socket: No; SMD: Yes; Manufacturer1 Example: YAGEO PHYCOMP; Manufacturer1 ComponentHeight: 0.4mm; HelpURL: \\cern.ch\dfs\Applications\Altium\Datasheets\R0402_Phycomp_RC0402.pdf; Author: CERN DEM JLC; CreateDate: 03.12.2007; LatestRevisionDate: 17.10.2012
R137 R265 R380 = R0402_13K_1%_0.0625W_100PPM: Resistor - 1%; Part Description: General Purpose Thick Film Chip Resistor; Manufacturer: GENERIC; Manufacturer1 Part Number: 232270671303L; TC: ±100ppm/°C; PressFit: No; Part Number: R0402_13K_1%_0.0625W_100PPM; Component Kind: Standard; Component Type: Standard; Pin Count: 2; Value: 13k; Status: Not Recommended; Power: 0.0625W; Tolerance: ±1%; Manufacturer Part Number: R0402_13K_1%_0.0625W_100PPM; Case: 0402; Mounted: Yes; Sense: No; Socket: No; SMD: Yes; Manufacturer1 Example: YAGEO PHYCOMP; Manufacturer1 ComponentHeight: 0.4mm; HelpURL: \\cern.ch\dfs\Applications\Altium\Datasheets\R0402_Phycomp_RC0402.pdf; Author: CERN DEM JLC; CreateDate: 03.12.2007; LatestRevisionDate: 17.10.2012
R139-R141 R143 = R0402_10K_1%_0.0625W_100PPM: Resistor - 1%; Part Description: General Purpose Thick Film Chip Resistor; Manufacturer: GENERIC; Manufacturer1 Part Number: 232270671003L; TC: ±100ppm/°C; Table: Resistors SMD; Part Number: R0402_10K_1%_0.0625W_100PPM; Component Kind: Standard; Component Type: Standard; Pin Count: 2; Value: 10k; Status: Not recommended; Power: 0.0625W; Tolerance: ±1%; Manufacturer Part Number: R0402_10K_1%_0.0625W_100PPM; Case: 0402; Mounted: Yes; Socket: No; SMD: Yes; Manufacturer1 Example: YAGEO PHYCOMP; Manufacturer1 ComponentHeight: 0.4mm; HelpURL: \\cern.ch\dfs\Applications\Altium\Datasheets\R0402_Phycomp_RC0402.pdf; Author: CERN DEM JLC; CreateDate: 2007-12-03; LatestRevisionDate: 2012-10-17
R215 R217 R439-R441 = R0402_1K_1%_0.0625W_100PPM: Resistor - 1%; Part Description: General Purpose Thick Film Chip Resistor; Manufacturer: GENERIC; Manufacturer1 Part Number: 232270671002L; TC: ±100ppm/°C; PressFit: No; Part Number: R0402_1K_1%_0.0625W_100PPM; Component Kind: Standard; Component Type: Standard; Pin Count: 2; Value: 1k; Status: Not Recommended; Power: 0.0625W; Tolerance: ±1%; Manufacturer Part Number: R0402_1K_1%_0.0625W_100PPM; Case: 0402; Mounted: Yes; Sense: No; Socket: No; SMD: Yes; Manufacturer1 Example: YAGEO PHYCOMP; Manufacturer1 ComponentHeight: 0.4mm; HelpURL: \\cern.ch\dfs\Applications\Altium\Datasheets\R0402_Phycomp_RC0402.pdf; Author: CERN DEM JLC; CreateDate: 03.12.2007; LatestRevisionDate: 17.10.2012
T7 = BC847BS: 45V 100mA Dual NPN General-Purpose Transistor; Manufacturer: NXP SEMICONDUCTORS; PressFit: No; Bonding: No; Part Number: BC847BS; Component Kind: Standard; Component Type: Standard; Device: BC847BS; PackageDescription: SOT363, SC-88, SOT, 0.65mm Pitch, 6 pin, 1.25mm W X 2.00mm L X 1.10mm H, IPC Medium Density; Part Description: 45V 100mA Dual NPN General-Purpose Transistor; Manufacturer Part Number: BC847BS; Pin Count: 6; Case: SOT363; Mounted: Yes; Socket: No; SMD: Yes; Sense: No; ComponentHeight: 1.1mm; HelpURL: \\cern.ch\dfs\Applications\Altium\Datasheets\BC847BS.pdf; Author: CERN DEM JMW; CreateDate: 10.07.2015; LatestRevisionDate: 10.07.2015
TP5 TP6 TP15 TP16 TP49-TP52 = SMD_PAD_1.27X1.27MM: Part Description: 1.27mm x 1.27mm PCB Copper Area (SMD Test Point); Mounted: No; Part Number: SMD_PAD_1.27X1.27MM; Component Kind: Standard (No BOM); Component Type: Standard (No BOM); Pin Count: 1; Family: Test Point; Socket: No; SMD: Yes; Sense: No; Status: None; ComponentHeight: 0mm; HelpURL: Undefined; Author: CERN DEM JLC; CreateDate: 12.01.2008; LatestRevisionDate: 12.01.2008; PackageDescription: 1.27mm x 1.27mm PCB Copper Area (SMD Test Point)